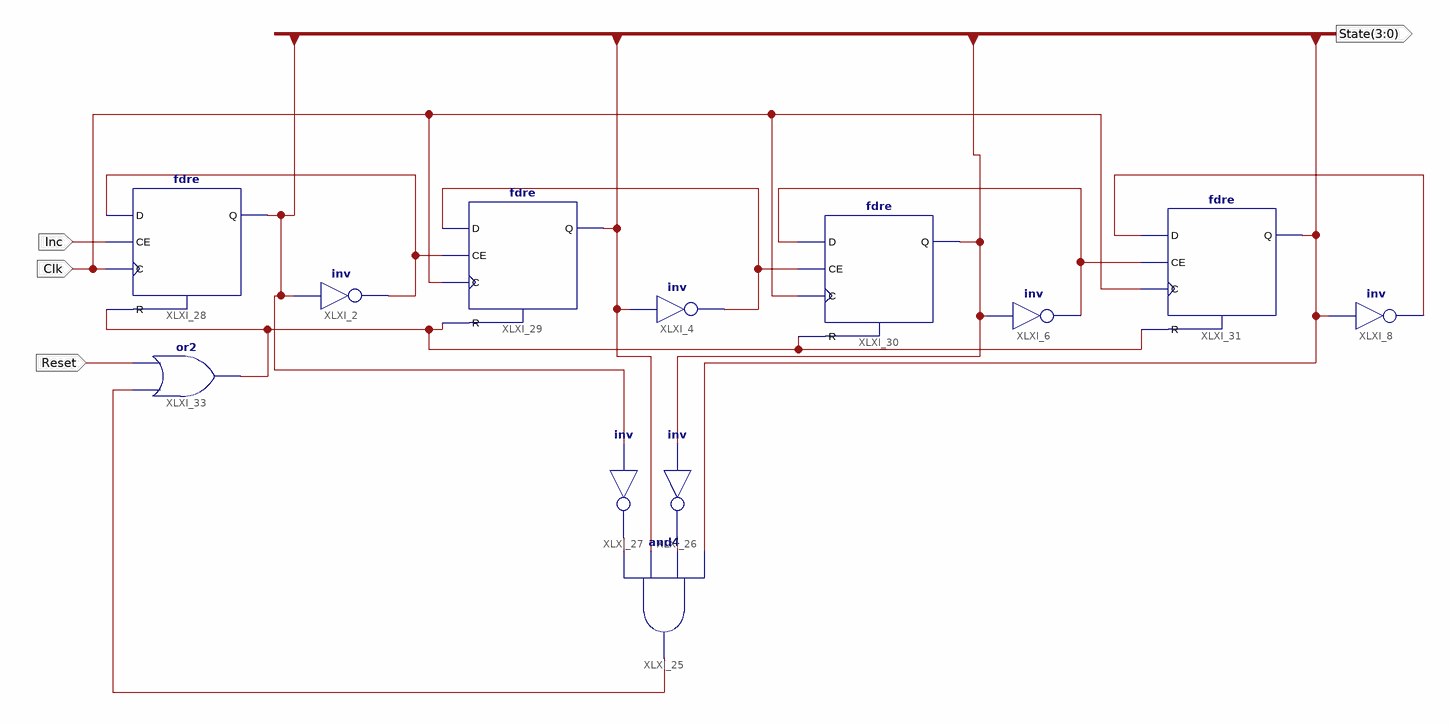
[diagram p0: schematic sheet 1]
// Xilinx ISE schematic Counter.sch (spartan3e) as structural Verilog: 12 symbols, 4 ports
module Counter (
  input  Inc,
  input  Clk,
  input  Reset,
  output [3:0] State
);

  wire XLXN_19, XLXN_20, XLXN_21, XLXN_22, XLXN_28, XLXN_29, XLXN_51, XLXN_54;

  not XLXI_2 (XLXN_19, State[0]);
  not XLXI_4 (XLXN_20, State[1]);
  not XLXI_6 (XLXN_21, State[2]);
  not XLXI_8 (XLXN_22, State[3]);
  and XLXI_25 (XLXN_51, XLXN_28, State[1], XLXN_29, State[3]);
  not XLXI_26 (XLXN_29, State[2]);
  not XLXI_27 (XLXN_28, State[0]);
  fdre XLXI_28 (.C(Clk), .CE(Inc), .D(XLXN_19), .R(XLXN_54), .Q(State[0]));
  fdre XLXI_29 (.C(Clk), .CE(XLXN_19), .D(XLXN_20), .R(XLXN_54), .Q(State[1]));
  fdre XLXI_31 (.C(Clk), .CE(XLXN_21), .D(XLXN_22), .R(XLXN_54), .Q(State[3]));
  fdre XLXI_30 (.C(Clk), .CE(XLXN_20), .D(XLXN_21), .R(XLXN_54), .Q(State[2]));
  or XLXI_33 (XLXN_54, XLXN_51, Reset);
endmodule
